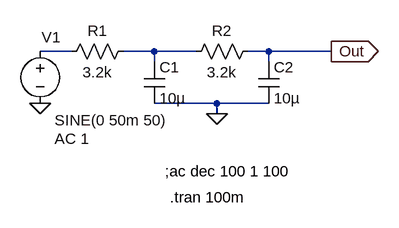
[diagram p0: schematic Lowpass Filter.asc]
Lowpass Filter.asc, the LTspice schematic file:
Version 4
SHEET 1 880 680
WIRE -96 16 -144 16
WIRE 32 16 -16 16
WIRE 96 16 32 16
WIRE 208 16 176 16
WIRE 304 16 208 16
WIRE 32 32 32 16
WIRE 208 32 208 16
WIRE 128 96 32 96
WIRE 208 96 128 96
WIRE 128 112 128 96
FLAG 128 112 0
FLAG 304 16 Out
IOPIN 304 16 Out
FLAG -144 96 0
SYMBOL res 0 0 R90
WINDOW 0 0 56 VBottom 2
WINDOW 3 32 56 VTop 2
SYMATTR InstName R1
SYMATTR Value 3.2k
SYMBOL res 192 0 R90
WINDOW 0 0 56 VBottom 2
WINDOW 3 32 56 VTop 2
SYMATTR InstName R2
SYMATTR Value 3.2k
SYMBOL cap 16 32 R0
SYMATTR InstName C1
SYMATTR Value 10µ
SYMBOL cap 192 32 R0
SYMATTR InstName C2
SYMATTR Value 10µ
SYMBOL voltage -144 0 R0
WINDOW 0 2 -6 Left 2
WINDOW 3 22 122 Left 2
WINDOW 123 22 150 Left 2
WINDOW 39 0 0 Left 0
SYMATTR InstName V1
SYMATTR Value SINE(0 50m 50)
SYMATTR Value2 AC 1
TEXT 48 200 Left 2 !;ac dec 100 1 100
TEXT 56 240 Left 2 !.tran 100m

The netlist it stands for:
* Lowpass Filter.asc
R1 N002 N001 3.2k
R2 Out N002 3.2k
C1 N002 0 10µ
C2 Out 0 10µ
V1 N001 0 SINE(0 50m 50) AC 1
;ac dec 100 1 100
.tran 100m
.backanno
.end